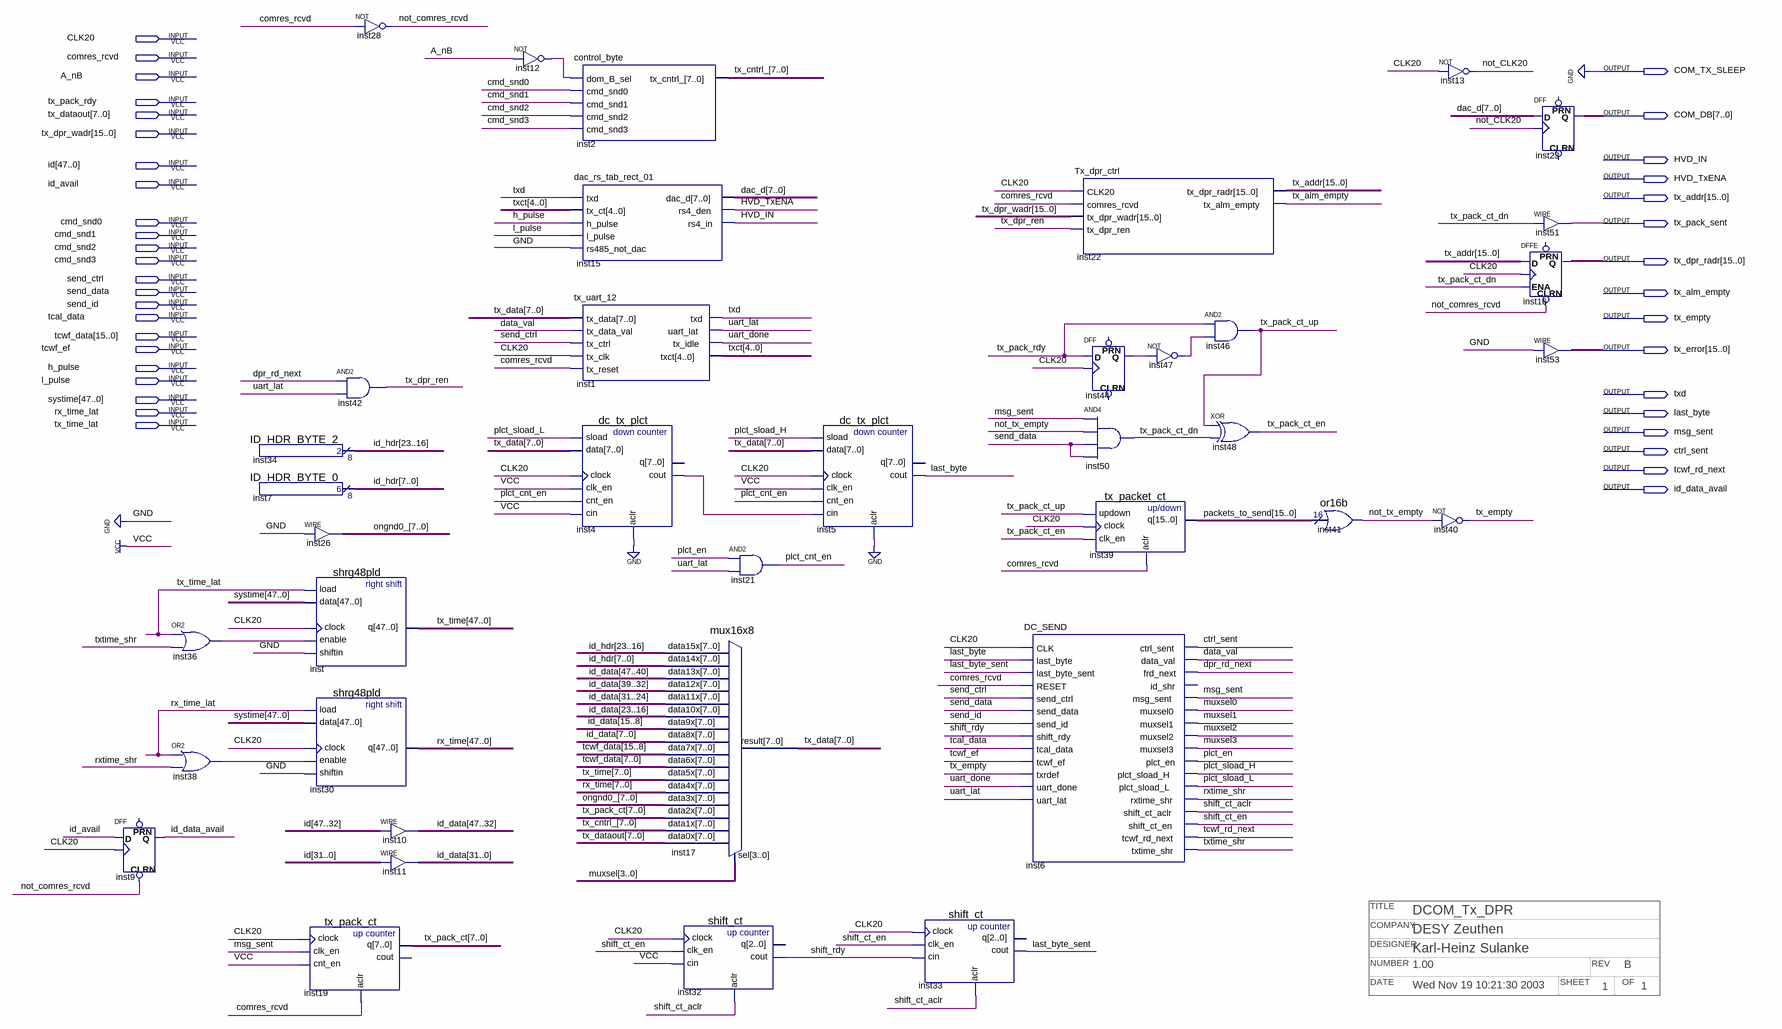
[diagram p0: schematic sheet]
// Quartus schematic DC_Tx_chan_dpr.bdf as structural Verilog: 38 symbols, 39 pins
// Title block: TITLE: DCOM_Tx_DPR; COMPANY: DESY Zeuthen; DESIGNER: Karl-Heinz Sulanke; NUMBER: 1.00; REV: B; DATE: Wed Nov 19 10:21:30 2003; SHEET: 1; OF: 1
module DC_Tx_chan_dpr (
  input  CLK20,
  input  comres_rcvd,
  input  A_nB,
  input  tx_pack_rdy,
  input  [7:0] tx_dataout,
  input  [15:0] tx_dpr_wadr,
  input  [47:0] id,
  input  id_avail,
  input  cmd_snd0,
  input  cmd_snd1,
  input  cmd_snd2,
  input  cmd_snd3,
  input  send_ctrl,
  input  send_data,
  input  send_id,
  input  tcal_data,
  input  [15:0] tcwf_data,
  input  tcwf_ef,
  input  h_pulse,
  input  l_pulse,
  input  [47:0] systime,
  input  rx_time_lat,
  input  tx_time_lat,
  output COM_TX_SLEEP,
  output [7:0] COM_DB,
  output HVD_IN,
  output HVD_TxENA,
  output [15:0] tx_addr,
  output tx_pack_sent,
  output [15:0] tx_dpr_radr,
  output tx_alm_empty,
  output tx_empty,
  output [15:0] tx_error,
  output txd,
  output last_byte,
  output msg_sent,
  output ctrl_sent,
  output tcwf_rd_next,
  output id_data_avail
);

  wire data_val, dpr_rd_next, inst4_cout, inst12_out, inst36_out, inst38_out, inst44_q, inst47_out,
       last_byte_sent, not_CLK20, not_comres_rcvd, not_tx_empty, plct_cnt_en, plct_en, plct_sload_H,
       plct_sload_L, rxtime_shr, shift_ct_aclr, shift_ct_en, shift_rdy, tx_dpr_ren, tx_pack_ct_dn,
       tx_pack_ct_en, tx_pack_ct_up, txtime_shr, uart_done, uart_lat;
  wire [3:0] muxsel;
  wire [4:0] txct;
  wire [7:0] dac_d, ongnd0_, tx_cntrl_, tx_data, tx_pack_ct;
  wire [15:0] packets_to_send;
  wire [23:0] id_hdr;
  wire [47:0] id_data, rx_time, tx_time;

  DFF inst9 (.CLRN(not_comres_rcvd), .CLK(CLK20), .D(id_avail), .Q(id_data_avail));  // open: PRN
  or inst36 (inst36_out, tx_time_lat, txtime_shr);
  or inst38 (inst38_out, rx_time_lat, rxtime_shr);
  ID_HDR_BYTE_2 inst34 (.result(id_hdr[23:16]));
  ID_HDR_BYTE_0 inst7 (.result(id_hdr[7:0]));
  tx_pack_ct inst19 (
    .clock(CLK20), .clk_en(msg_sent), .cnt_en(1'b1), .aclr(comres_rcvd), .q(tx_pack_ct));  // open: cout
  and inst42 (tx_dpr_ren, dpr_rd_next, uart_lat);
  assign ongnd0_ = {8{1'b0}};  // WIRE inst26
  shrg48pld inst (.load(tx_time_lat), .data(systime), .clock(CLK20), .enable(inst36_out), .shiftin(1'b0), .q(tx_time));
  shrg48pld inst30 (
    .load(rx_time_lat), .data(systime), .clock(CLK20), .enable(inst38_out), .shiftin(1'b0), .q(rx_time));
  not inst28 (not_comres_rcvd, comres_rcvd);
  assign id_data[47:32] = id[47:32];  // WIRE inst10
  assign id_data[31:0] = id[31:0];  // WIRE inst11
  not inst12 (inst12_out, A_nB);
  control_byte inst2 (
    .dom_B_sel(inst12_out), .cmd_snd0(cmd_snd0), .cmd_snd1(cmd_snd1), .cmd_snd2(cmd_snd2),
    .cmd_snd3(cmd_snd3), .tx_cntrl_(tx_cntrl_));
  dac_rs_tab_rect_01 inst15 (
    .txd(txd), .tx_ct(txct), .h_pulse(h_pulse), .l_pulse(l_pulse), .rs485_not_dac(1'b0), .dac_d(dac_d),
    .rs4_den(HVD_TxENA), .rs4_in(HVD_IN));
  tx_uart_12 inst1 (
    .tx_data(tx_data), .tx_data_val(data_val), .tx_ctrl(send_ctrl), .tx_clk(CLK20), .tx_reset(comres_rcvd),
    .txd(txd), .uart_lat(uart_lat), .tx_idle(uart_done), .txct(txct));
  dc_tx_plct inst4 (
    .sload(plct_sload_L), .data(tx_data), .clock(CLK20), .clk_en(1'b1), .cnt_en(plct_cnt_en), .cin(1'b1),
    .aclr(1'b0), .cout(inst4_cout));  // open: q
  mux16x8 inst17 (
    .data15x(id_hdr[23:16]), .data14x(id_hdr[7:0]), .data13x(id_data[47:40]), .data12x(id_data[39:32]),
    .data11x(id_data[31:24]), .data10x(id_data[23:16]), .data9x(id_data[15:8]), .data8x(id_data[7:0]),
    .data7x(tcwf_data[15:8]), .data6x(tcwf_data[7:0]), .data5x(tx_time[7:0]), .data4x(rx_time[7:0]),
    .data3x(ongnd0_), .data2x(tx_pack_ct), .data1x(tx_cntrl_), .data0x(tx_dataout), .sel(muxsel),
    .result(tx_data));
  shift_ct inst32 (.clock(CLK20), .clk_en(shift_ct_en), .cin(1'b1), .aclr(shift_ct_aclr), .cout(shift_rdy));  // open: q
  and inst21 (plct_cnt_en, plct_en, uart_lat);
  dc_tx_plct inst5 (
    .sload(plct_sload_H), .data(tx_data), .clock(CLK20), .clk_en(1'b1), .cnt_en(plct_cnt_en),
    .cin(inst4_cout), .aclr(1'b0), .cout(last_byte));  // open: q
  shift_ct inst33 (
    .clock(CLK20), .clk_en(shift_ct_en), .cin(shift_rdy), .aclr(shift_ct_aclr), .cout(last_byte_sent));  // open: q
  DC_SEND inst6 (
    .CLK(CLK20), .last_byte(last_byte), .last_byte_sent(last_byte_sent), .RESET(comres_rcvd),
    .send_ctrl(send_ctrl), .send_data(send_data), .send_id(send_id), .shift_rdy(shift_rdy),
    .tcal_data(tcal_data), .tcwf_ef(tcwf_ef), .txrdef(tx_empty), .uart_done(uart_done), .uart_lat(uart_lat),
    .ctrl_sent(ctrl_sent), .data_val(data_val), .frd_next(dpr_rd_next), .msg_sent(msg_sent),
    .muxsel0(muxsel[0]), .muxsel1(muxsel[1]), .muxsel2(muxsel[2]), .muxsel3(muxsel[3]), .plct_en(plct_en),
    .plct_sload_H(plct_sload_H), .plct_sload_L(plct_sload_L), .rxtime_shr(rxtime_shr),
    .shift_ct_aclr(shift_ct_aclr), .shift_ct_en(shift_ct_en), .tcwf_rd_next(tcwf_rd_next),
    .txtime_shr(txtime_shr));  // open: id_shr
  Tx_dpr_ctrl inst22 (
    .CLK20(CLK20), .comres_rcvd(comres_rcvd), .tx_dpr_wadr(tx_dpr_wadr), .tx_dpr_ren(tx_dpr_ren),
    .tx_dpr_radr(tx_addr), .tx_alm_empty(tx_alm_empty));
  DFF inst44 (.CLK(CLK20), .D(tx_pack_rdy), .Q(inst44_q));  // open: CLRN, PRN
  and inst50 (tx_pack_ct_dn, msg_sent, not_tx_empty, send_data, send_data);
  tx_packet_ct inst39 (
    .updown(tx_pack_ct_up), .clock(CLK20), .clk_en(tx_pack_ct_en), .aclr(comres_rcvd), .q(packets_to_send));
  not inst47 (inst47_out, inst44_q);
  and inst46 (tx_pack_ct_up, tx_pack_rdy, inst47_out);
  xor inst48 (tx_pack_ct_en, tx_pack_ct_up, tx_pack_ct_dn);
  or16b inst41 (.data(packets_to_send), .result(not_tx_empty));
  not inst13 (not_CLK20, CLK20);
  not inst40 (tx_empty, not_tx_empty);
  DFF inst23[7:0] (.CLK(not_CLK20), .D(dac_d), .Q(COM_DB));  // open: CLRN, PRN
  assign tx_pack_sent = tx_pack_ct_dn;  // WIRE inst51
  DFFE inst16[15:0] (
    .CLRN(not_comres_rcvd), .D(tx_addr), .CLK(CLK20), .ENA(tx_pack_ct_dn), .Q(tx_dpr_radr));  // open: PRN
  assign tx_error = {16{1'b0}};  // WIRE inst53

  assign COM_TX_SLEEP = 1'b0;
endmodule
